# EAGLE design RtNixie (EAGLE 6.1)
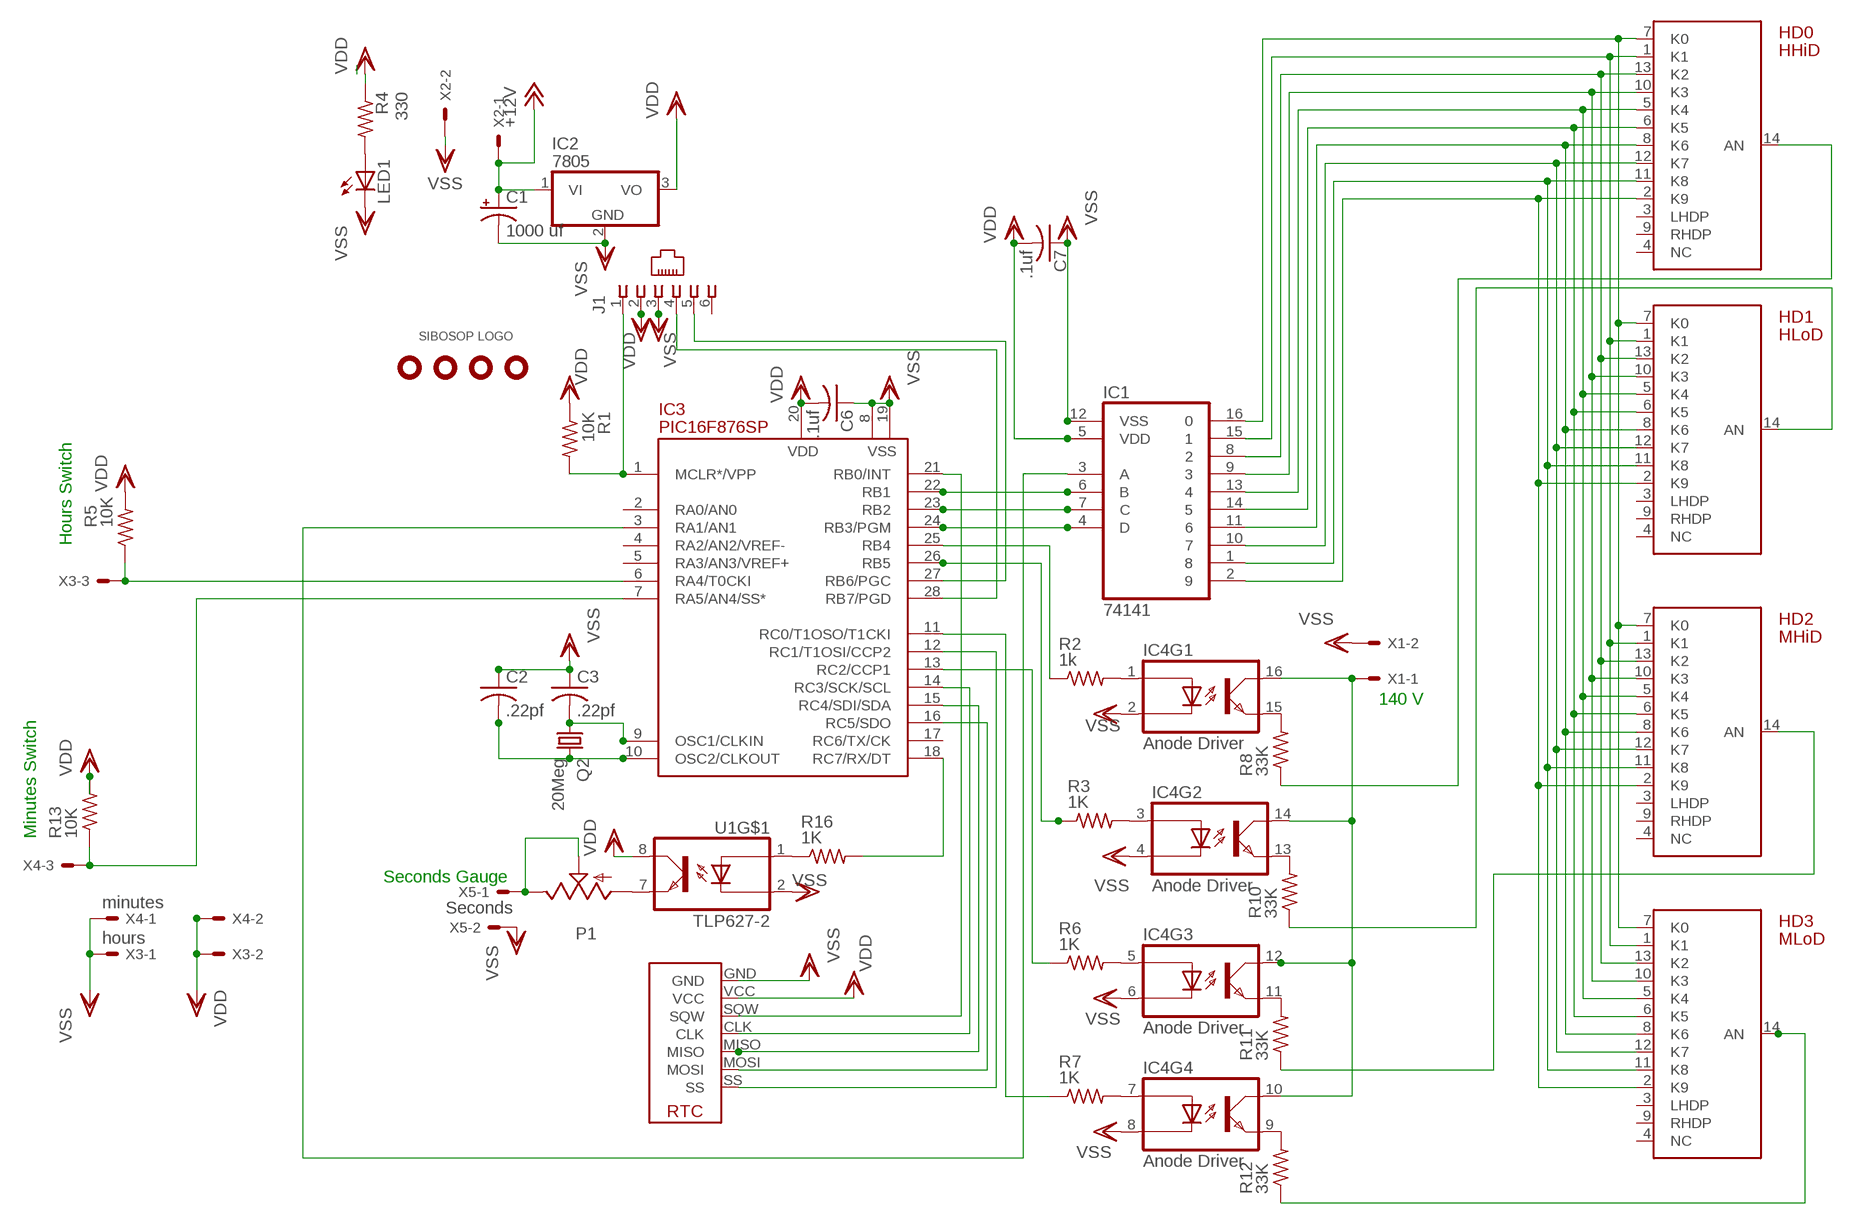
[diagram p0: schematic, sheet 1]

## Parts
C1  1000 uf  CPOL-USE3.5-10  [E3,5-10]
C2  .22pf  C-US025-024X044  [C025-024X044]
C3  .22pf  C-US025-024X044  [C025-024X044]
C6  .1uf  C-US025-024X044  [C025-024X044]
C7  .1uf  C-US025-024X044  [C025-024X044]
HD0  HHiD  NIXIE-5440-HEADER  [DIL14]
HD1  HLoD  NIXIE-5440-HEADER  [DIL14]
HD2  MHiD  NIXIE-5440-HEADER  [DIL14]
HD3  MLoD  NIXIE-5440-HEADER  [DIL14]
IC1  74141  [DIP16]
IC2  7805  [TO220V]
IC3  PIC16F876SP  [DIL28-3]
IC4  Anode Driver  TLP627  [DIP16]
IC5  SPARKRTC  [SPARKRTC]
J1  520250-3  [520250-3]
LED1  LEDSQR2X5  [LED2X5]
P1  TRIMPOT  [RJ6S]
Q2  20Meg  CRYSTALHC49S  [HC49/S]
R1  10K  R-US_0204/2V  [0204V]
R2  1k  R-US_0204/2V  [0204V]
R3  1K  R-US_0204/2V  [0204V]
R4  330  R-US_0204/2V  [0204V]
R5  10K  R-US_0204/2V  [0204V]
R6  1K  R-US_0204/2V  [0204V]
R7  1K  R-US_0204/2V  [0204V]
R8  33K  R-US_0204/2V  [0204V]
R10  33K  R-US_0204/2V  [0204V]
R11  33K  R-US_0204/2V  [0204V]
R12  33K  R-US_0204/2V  [0204V]
R13  10K  R-US_0204/2V  [0204V]
R16  1K  R-US_0204/2V  [0204V]
U1  TLP627-2  [DIL8]
U$1  HOLE-125  [HOLE-125]
U$2  HOLE-125  [HOLE-125]
U$3  LOGO  [LOGO]
U$5  HOLE-125  [HOLE-125]
U$7  HOLE-125  [HOLE-125]
X1  22-23-2021  [22-23-2021]
X2  22-23-2021  [22-23-2021]
X3  hours  22-23-2031  [22-23-2031]
X4  minutes  22-23-2031  [22-23-2031]
X5  Seconds  22-23-2021  [22-23-2021]

## Nets
+12V: C1.+ IC2.1(VI) X2.1
N$1: IC3.28(RB7/PGD) J1.4
N$2: IC3.7(RA5/AN4/SS*) R13.1 X4.3
N$3: C2.2 IC3.10(OSC2/CLKOUT) Q2.2
N$4: C3.2 IC3.9(OSC1/CLKIN) Q2.1
N$5: IC3.27(RB6/PGC) J1.5
N$6: IC3.1(MCLR*/VPP) J1.1 R1.2
N$7: HD0.7(K0) HD1.7(K0) HD2.7(K0) HD3.7(K0) IC1.16
N$8: HD0.1(K1) HD1.1(K1) HD2.1(K1) HD3.1(K1) IC1.15
N$9: HD0.13(K2) HD1.13(K2) HD2.13(K2) HD3.13(K2) IC1.8
N$10: HD0.10(K3) HD1.10(K3) HD2.10(K3) HD3.10(K3) IC1.9
N$11: HD0.5(K4) HD1.5(K4) HD2.5(K4) HD3.5(K4) IC1.13
N$12: P1.E P1.S X5.1
N$13: HD0.8(K6) HD1.8(K6) HD2.8(K6) HD3.8(K6) IC1.11
N$14: HD0.12(K7) HD1.12(K7) HD2.12(K7) HD3.12(K7) IC1.10
N$15: HD0.11(K8) HD1.11(K8) HD2.11(K8) HD3.11(K8) IC1.1
N$16: HD0.2(K9) HD1.2(K9) HD2.2(K9) HD3.2(K9) IC1.2
N$17: IC1.6(B) IC3.22(RB1)
N$18: IC1.7(C) IC3.23(RB2)
N$19: IC1.4(D) IC3.24(RB3/PGM)
N$20: IC3.21(RB0/INT) IC5.SQW
N$21: HD0.6(K5) HD1.6(K5) HD2.6(K5) HD3.6(K5) IC1.14
N$22: LED1.A R4.2
N$23: P1.A U1.7(EM)
N$24: IC4.1(AN) R2.2
N$25: IC4.5(AN) R6.2
N$26: IC4.7(AN) R7.2
N$27: IC3.25(RB4) R2.1
N$28: IC3.26(RB5) R3.1
N$29: IC3.13(RC2/CCP1) R6.1
N$30: R16.1 U1.1(AN)
N$31: IC3.14(RC3/SCK/SCL) IC5.CLK
N$32: IC3.6(RA4/T0CKI) R5.1 X3.3
N$33: IC4.3(AN) R3.2
N$34: IC3.15(RC4/SDI/SDA) IC5.MISO
N$35: IC4.15(EM) R8.2
N$36: IC4.13(EM) R10.2
N$37: IC4.11(EM) R11.2
N$38: IC4.9(EM) R12.2
N$39: HD0.14(AN) R8.1
N$40: HD1.14(AN) R10.1
N$41: HD2.14(AN) R11.1
N$42: HD3.14(AN) R12.1
N$43: IC3.16(RC5/SDO) IC5.MOSI
N$44: IC1.3(A) IC3.3(RA1/AN1)
N$45: IC3.11(RC0/T1OSO/T1CKI) R7.1
N$46: IC3.12(RC1/T1OSI/CCP2) IC5.SS
N$57: IC3.18(RC7/RX/DT) R16.2
N$61: IC4.10(CO) IC4.12(CO) IC4.14(CO) IC4.16(CO) X1.1
VDD: C6.2 C7.2 IC1.5(VDD) IC2.3(VO) IC3.20(VDD) IC5.VCC J1.2 R1.1 R4.1 R5.2 R13.2 U1.8(CO) X3.2 X4.2
VSS: C1.- C2.1 C3.1 C6.1 C7.1 IC1.12(VSS) IC2.2(GND) IC3.8(VSS) IC3.19(VSS) IC4.2(CA) IC4.4(CA) IC4.6(CA) IC4.8(CA) IC5.GND J1.3 LED1.K(C) U1.2(CA) X1.2 X2.2 X3.1 X4.1 X5.2
Unconnected: HD0.3(LHDP) HD0.4(NC) HD0.9(RHDP) HD1.3(LHDP) HD1.4(NC) HD1.9(RHDP) HD2.3(LHDP) HD2.4(NC) HD2.9(RHDP) HD3.3(LHDP) HD3.4(NC) HD3.9(RHDP) IC3.2(RA0/AN0) IC3.4(RA2/AN2/VREF-) IC3.5(RA3/AN3/VREF+) IC3.17(RC6/TX/CK) J1.6 U1.3(AN) U1.4(CA) U1.5(EM) U1.6(CO)

## Notes on the sheet
- Hours Switch
- 140 V
- Minutes Switch
- Seconds Gauge

## Library data of the parts
C1 = rcl:CPOL-US: POLARIZED CAPACITOR, American symbol
C2 C3 C6 C7 = rcl:C-US: CAPACITOR, American symbol
HD0 HD1-HD3 = sibosop:NIXIE-5440-HEADER: 14 pin dip header used to interface with a Nixie 5440 type tube
IC1 = sibosop:74141: Nixie BCD Decoder
IC2 = kmarx1:78*: 78xx Family - Positive voltage regulator
IC3 = pic16f87x:PIC16F876: FLASH MICROCONTROLLER
IC4 = sibosop:TLP627: Toshiba 4 unit photocoupler
IC5 = sibosop:SPARKRTC: spark fun deadon rtc breakout board
J1 = con-amp:520250-3: AMP connector
LED1 = led:LED: LED OSRAM: - CHIPLED LG R971, LG N971, LY N971, LG Q971, LY Q971, LO R971, LY R971 LH N974, LH R974 LS Q976, LO Q976, LY Q976 LO Q996 - Hyper CHIPLED LW Q18S LB Q993, LB Q99A, LB R99A - SideLED LS A670, LO A670, LY A670, LG A670, LP A670 LB A673, LV A673, LT A673, LW A673 LH A674 LY A675 LS A676, LA A676, LO A676, LY A676, LW A676 LS A679, LY A679, LG A679 - Hyper Micro SIDELED® LS Y876, LA Y876, LO Y876, LY Y876 LT Y87S - SmartLED LW L88C, LW L88S LB L89C, LB L89S, LG L890 LS L89K, LO L89K, LY L89K LS L896, LA L896, LO L896, LY L896 - TOPLED LS T670, LO T670, LY T670, LG T670, LP T670 LSG T670, LSP T670, LSY T670, LOP T670, LYG T670 LG T671, LOG T671, LSG T671 LB T673, LV T673, LT T673, LW T673 LH T674 LS T676, LA T676, LO T676, LY T676, LB T676, LH T676, LSB T676, LW T676 LB T67C, LV T67C, LT T67C, LS T67K, LO T67K, LY T67K, LW E67C LS E67B, LA E67B, LO E67B, LY E67B, LB E67C, LV E67C, LT E67C LW T67C LS T679, LY T679, LG T679 LS T770, LO T770, LY T770, LG T770, LP T770 LB T773, LV T773, LT T773, LW T773 LH T774 LS E675, LA E675, LY E675, LS T675 LS T776, LA T776, LO T776, LY T776, LB T776 LHGB T686 LT T68C, LB T68C - Hyper Mini TOPLED® LB M676 - Mini TOPLED Santana® LG M470 LS M47K, LO M47K, LY M47K Source: http://www.osram.convergy.de LUXEON: - LUMILED® LXK2-PW12-R00, LXK2-PW12-S00, LXK2-PW14-U00, LXK2-PW14-V00 LXK2-PM12-R00, LXK2-PM12-S00, LXK2-PM14-U00 LXK2-PE12-Q00, LXK2-PE12-R00, LXK2-PE12-S00, LXK2-PE14-T00, LXK2-PE14-U00 LXK2-PB12-K00, LXK2-PB12-L00, LXK2-PB12-M00, LXK2-PB14-N00, LXK2-PB14-P00, LXK2-PB14-Q00 LXK2-PR12-L00, LXK2-PR12-M00, LXK2-PR14-Q00, LXK2-PR14-R00 LXK2-PD12-Q00, LXK2-PD12-R00, LXK2-PD12-S00 LXK2-PH12-R00, LXK2-PH12-S00 LXK2-PL12-P00, LXK2-PL12-Q00, LXK2-PL12-R00 Source: www.luxeon.com KINGBRIGHT: KA-3528ASYC Source: www.kingbright.com
P1 = sibosop:TRIMPOT
Q2 = crystal:CRYSTAL: CRYSTAL; OC_FARNELL: 1667008; OC_NEWARK: unknown
R1-R8 R10-R13 R16 = rcl:R-US_: RESISTOR, American symbol
U1 = sibosop:TLP627-2: 2 unit Hi voltage opto-isolator
U$1 U$2 U$5 U$7 = sibosop:HOLE-125
U$3 = sibosop:LOGO
X1 X2 X5 = sibosop-con-molex:22-23-2021: .100" (2.54mm) Center Header - 2 Pin
X3 X4 = sibosop-con-molex:22-23-2031: .100" (2.54mm) Center Header - 3 Pin

## Board
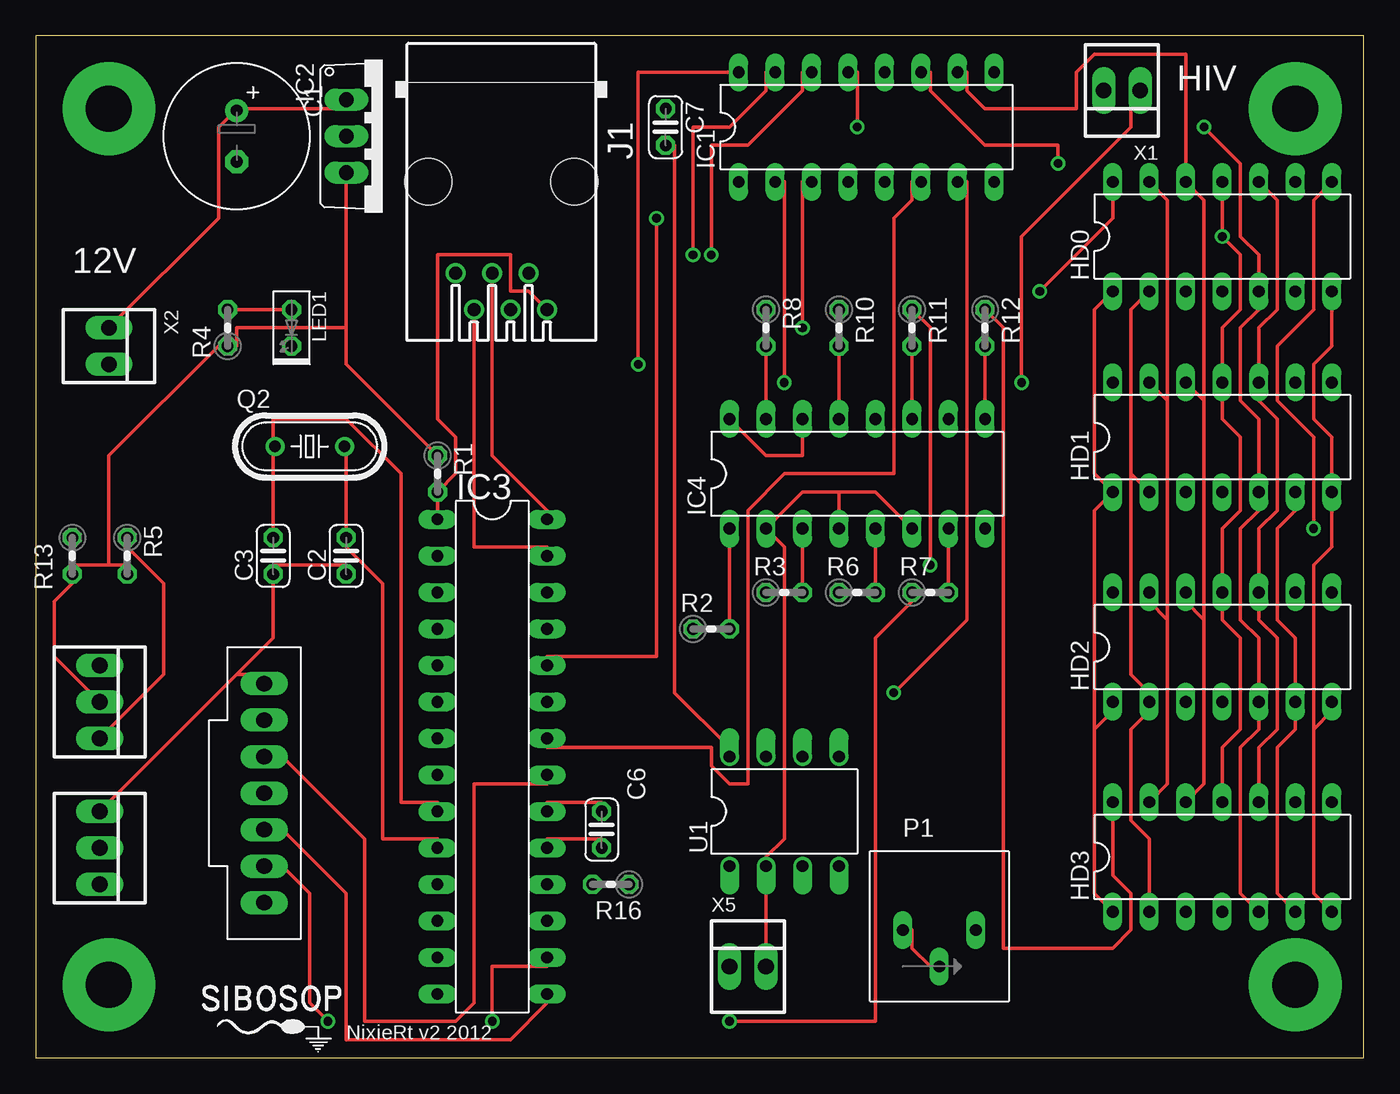
[diagram p1: board, top side]
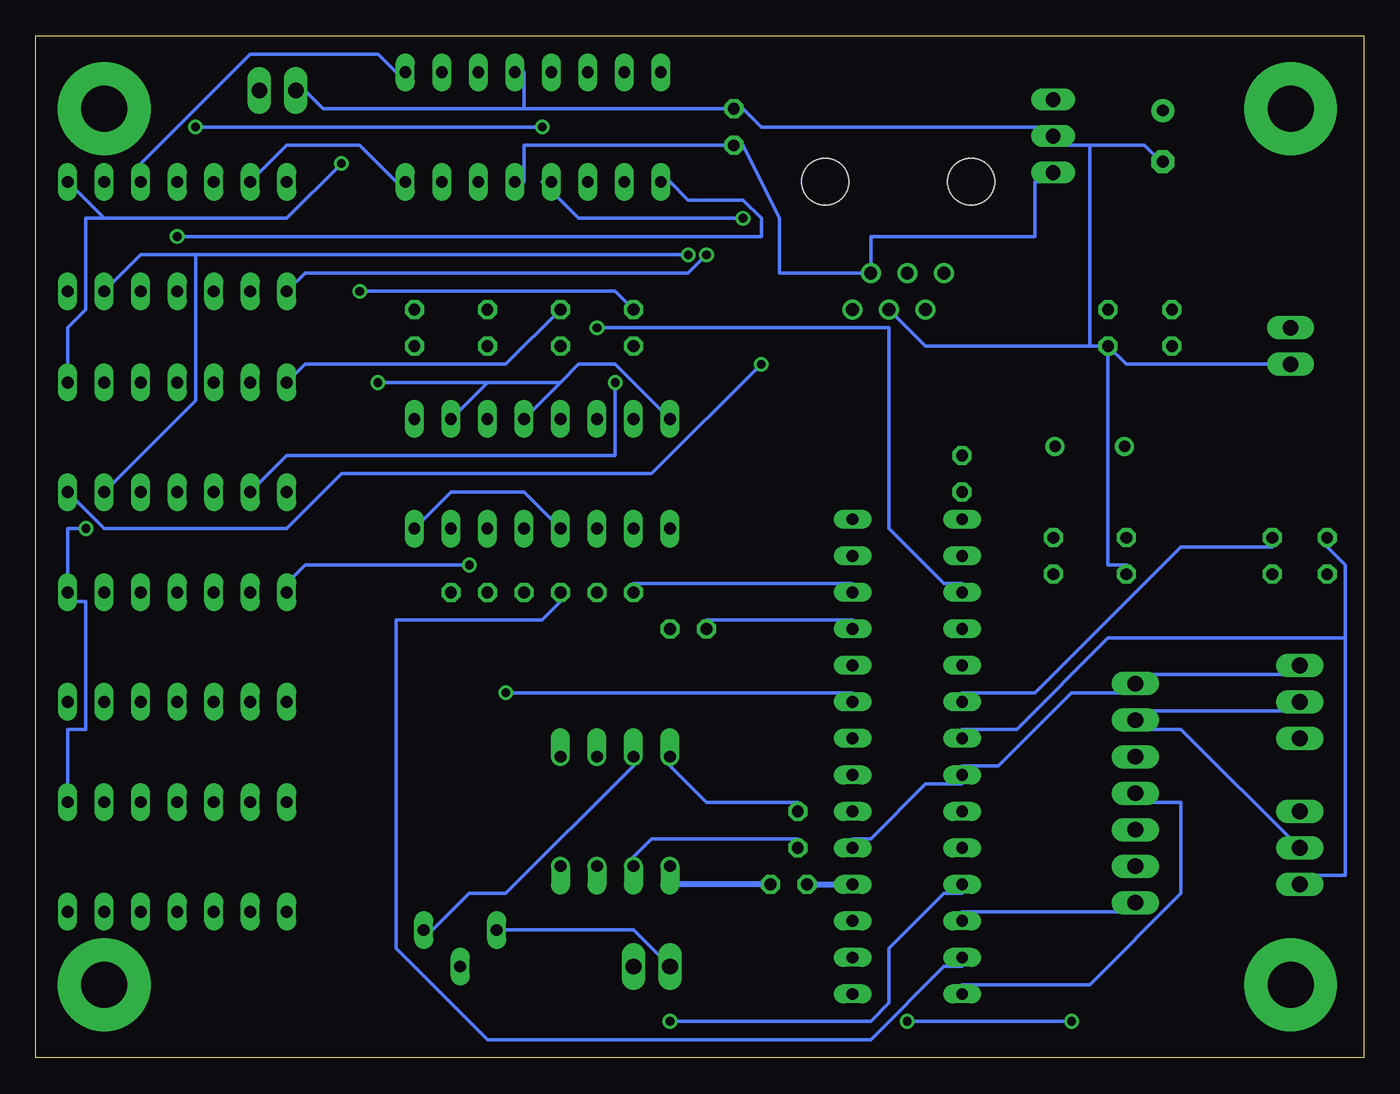
[diagram p2: board, bottom side, seen from below]

Size 92.38 x 71.11 mm. Coordinates in mm from the lower left corner, seen from the top.
Outline: 0,0 92.38,0 92.38,71.11 0,71.11 0,0
Copper layers (1*16): Top 0.035mm / dielectric 1.5mm / Bottom 0.035mm
Design rules: minimum track width 10mil, minimum drill 24mil, track to track 8mil, track to pad 8mil, pad to pad 8mil, via to via 8mil, smd to smd 8mil, copper to edge 40mil, drill to drill 8mil, minimum pad ring 10mil, minimum via ring 8mil, stop-mask expansion 4mil, vias tented up to drill 0mil, thermal gap 10mil

### Footprints (pad centres in the part's own frame; a part is rotated, then mirrored left to right if it is on the bottom)
E3,5-10 = drill 0.813 pad 1.6: + -1.778,0 | drill 0.813 pad 1.6 octagon: - 1.778,0
C025-024X044 = drill 0.813 octagon: 1 -1.27,0; 2 1.27,0
DIL14 = drill 0.813 long: 1 -7.62,-3.81; 2 -5.08,-3.81; 3 -2.54,-3.81; 4 0,-3.81; 5 2.54,-3.81; 6 5.08,-3.81; 7 7.62,-3.81; 8 7.62,3.81; 9 5.08,3.81; 10 2.54,3.81; 11 0,3.81; 12 -2.54,3.81; 13 -5.08,3.81; 14 -7.62,3.81
DIP16 = drill 0.813 long: 1 -8.89,-3.81; 2 -6.35,-3.81; 3 -3.81,-3.81; 4 -1.27,-3.81; 5 1.27,-3.81; 6 3.81,-3.81; 7 6.35,-3.81; 8 8.89,-3.81; 9 8.89,3.81; 10 6.35,3.81; 11 3.81,3.81; 12 1.27,3.81; 13 -1.27,3.81; 14 -3.81,3.81; 15 -6.35,3.81; 16 -8.89,3.81
TO220V = drill 1.016 long: 1 -2.54,0; 2 0,0; 3 2.54,0
DIL28-3 = drill 0.813 long: 1 -16.51,-3.81; 2 -13.97,-3.81; 3 -11.43,-3.81; 4 -8.89,-3.81; 5 -6.35,-3.81; 6 -3.81,-3.81; 7 -1.27,-3.81; 8 1.27,-3.81; 9 3.81,-3.81; 10 6.35,-3.81; 11 8.89,-3.81; 12 11.43,-3.81; 13 13.97,-3.81; 14 16.51,-3.81; 15 16.51,3.81; 16 13.97,3.81; 17 11.43,3.81; 18 8.89,3.81; 19 6.35,3.81; 20 3.81,3.81; 21 1.27,3.81; 22 -1.27,3.81; 23 -3.81,3.81; 24 -6.35,3.81; 25 -8.89,3.81; 26 -11.43,3.81; 27 -13.97,3.81; 28 -16.51,3.81
SPARKRTC = drill 1.1 long: CLK 0,0; GND 0,-7.62; MISO 0,2.54; MOSI 0,5.08; SQW 0,-2.54; SS 0,7.62; VCC 0,-5.08
520250-3 = drill 0.889: 1 -3.175,8.89; 2 -1.905,6.35; 3 -0.635,8.89; 4 0.635,6.35; 5 1.905,8.89; 6 3.175,6.35 | hole 3.251: -5.08,0; 5.08,0
LED2X5 = drill 0.813 octagon: A -1.27,0; K 1.27,0
RJ6S = drill 0.813 long: A 2.54,0; E -2.54,0; S 0,-2.54
HC49/S = drill 0.813: 1 -2.413,0; 2 2.413,0
0204V = drill 0.813 octagon: 1 -1.27,0; 2 1.27,0
DIL8 = drill 0.813 offset: 1 -3.81,-3.81; 2 -1.27,-3.81; 3 1.27,-3.81; 4 3.81,-3.81; 5 3.81,3.81; 6 1.27,3.81; 7 -1.27,3.81; 8 -3.81,3.81
HOLE-125 = drill 3.2 pad 6.452: P$1 0,0
22-23-2021 = drill 1.1 long: 1 -1.27,0; 2 1.27,0
22-23-2031 = drill 1.1 long: 1 -2.54,0; 2 0,0; 3 2.54,0

### Placement (x,y rotation side)
C1  13.97,64.14 270 top
C2  21.59,34.92 90 top
C3  16.51,34.92 90 top
C6  39.37,15.88 90 top
C7  43.81,64.77 270 top
HD0  82.55,57.15 0 top
HD1  82.55,43.18 0 top
HD2  82.55,28.57 0 top
HD3  82.55,13.97 0 top
IC1  57.78,64.77 0 top
IC2  21.59,64.14 270 top
IC3  31.75,20.95 270 top
IC4  57.15,40.64 0 top
IC5  15.88,18.41 180 top
J1  32.38,60.96 180 top
LED1  17.78,50.8 270 top
P1  62.87,8.89 0 top
Q2  19.05,42.55 0 top
R1  27.94,40.64 270 top
R2  46.99,29.84 0 top
R3  52.07,32.38 0 top
R4  13.34,50.8 90 top
R5  6.35,34.92 270 top
R6  57.15,32.38 0 top
R7  62.23,32.38 0 top
R8  50.8,50.8 270 top
R10  55.88,50.8 270 top
R11  60.96,50.8 270 top
R12  66.04,50.8 270 top
R13  2.54,34.92 270 top
R16  40.01,12.06 180 top
U1  52.07,17.14 0 top
U$1  5.08,66.04 0 top
U$2  5.08,5.08 0 top
U$3  15.88,3.81 0 top
U$5  87.63,5.08 0 top
U$7  87.63,66.04 0 top
X1  75.56,67.31 180 top
X2  5.08,49.53 270 top
X3  4.45,24.77 270 top
X4  4.45,14.61 270 top
X5  49.53,6.35 0 top

### Tracks (layer width: path | path; a pad name or v marks a point on that pad's centre or on a via)
+12V
  Top 0.254: 13.97,66.04 21.59,66.04 IC2.1 | X2.1 12.7,58.42 12.7,64.77 13.97,66.04 | 13.97,66.04 C1.+
N$1
  Top 0.254: J1.4 31.75,41.91 35.56,38.1 IC3.28
N$2
  Bottom 0.254: 1.27,29.21 1.27,12.7 3.81,12.7 X4.3 | 1.27,29.21 1.27,34.29 2.54,35.56 R13.1 | 1.27,29.21 17.78,29.21 24.13,22.86 27.94,22.86 IC3.7
N$3
  Top 0.254: Q2.2 21.59,41.91 C2.2 21.59,35.56 24.13,33.02 24.13,15.24 27.94,15.24 IC3.10
N$4
  Top 0.254: C3.2 16.51,41.91 Q2.1 16.51,43.18 16.51,44.45 21.59,44.45 25.4,40.64 25.4,17.78 27.94,17.78 IC3.9
N$5
  Top 0.254: J1.5 30.48,35.56 35.56,35.56 IC3.27
N$6
  Top 0.254: IC3.1 R1.2 29.21,40.64 29.21,43.18 27.94,44.45 27.94,55.88 33.02,55.88 33.02,53.34 34.29,53.34 J1.1
N$7  (via drill 0.61)
  Top 0.254: HD3.7 88.9,11.43 88.9,22.86 | 88.9,22.86 90.17,24.13 HD2.7 | 88.9,22.86 88.9,34.29 90.17,35.56 HD1.7 90.17,43.18 88.9,44.45 88.9,48.26 90.17,49.53 HD0.7 | IC1.16 41.91,68.58 v41.91,48.26
  Bottom 0.254: v41.91,48.26 49.53,40.64 71.12,40.64 74.93,36.83 87.63,36.83 HD1.7
N$8  (via drill 0.61)
  Top 0.254: HD3.1 73.66,11.43 73.66,22.86 | 73.66,22.86 74.93,24.13 HD2.1 | 73.66,22.86 73.66,38.1 HD1.1 73.66,40.64 73.66,52.07 HD0.1 | v45.72,55.88 45.72,64.77 48.26,64.77 50.8,67.31 50.8,68.58 IC1.15
  Bottom 0.254: v45.72,55.88 46.99,54.61 73.66,54.61 HD0.1
N$9
  Top 0.254: HD3.13 78.74,19.05 78.74,30.48 | 78.74,30.48 77.47,31.75 HD2.13 | 78.74,45.72 HD1.13 | 78.74,30.48 78.74,45.72 | HD0.13 78.74,59.69 78.74,45.72
  Bottom 0.254: HD0.13 74.93,63.5 69.85,63.5 67.31,60.96 IC1.8
N$10
  Top 0.254: HD3.10 85.09,21.59 86.36,22.86 86.36,29.21 85.09,30.48 HD2.10 85.09,36.83 86.36,38.1 86.36,44.45 85.09,45.72 HD1.10 85.09,50.8 86.36,52.07 86.36,59.69 HD0.10
  Bottom 0.254: HD0.10 85.09,62.23 77.47,69.85 68.58,69.85 67.31,68.58 IC1.9
N$11  (via drill 0.61)
  Top 0.254: HD3.5 83.82,11.43 83.82,21.59 85.09,22.86 HD2.5 85.09,29.21 83.82,30.48 83.82,36.83 85.09,38.1 HD1.5 85.09,44.45 83.82,45.72 83.82,50.8 85.09,52.07 HD0.5 85.09,55.88 83.82,57.15 83.82,62.23 v81.28,64.77 | v57.15,64.77 57.15,68.58 IC1.13
  Bottom 0.254: v81.28,64.77 v57.15,64.77
N$12
  Top 0.254: P1.S 62.23,6.35 60.96,7.62 60.96,8.89 P1.E
  Bottom 0.254: X5.1 50.8,8.89 P1.E
N$13  (via drill 0.61)
  Top 0.254: v71.12,62.23 71.12,63.5 66.04,63.5 62.23,67.31 62.23,68.58 IC1.11 | v88.9,36.83 88.9,43.18 86.36,45.72 86.36,49.53 88.9,52.07 88.9,59.69 HD0.8
  Bottom 0.254: HD3.8 90.17,22.86 88.9,22.86 88.9,31.75 90.17,31.75 HD2.8 90.17,36.83 v88.9,36.83 | v71.12,62.23 74.93,58.42 87.63,58.42 | HD0.8 87.63,58.42 | HD1.8 90.17,50.8 88.9,52.07 88.9,58.42 87.63,58.42
N$14
  Top 0.254: HD3.12 81.28,19.05 81.28,30.48 | 81.28,30.48 80.01,31.75 HD2.12 | 81.28,45.72 HD1.12 | 81.28,30.48 81.28,45.72 | 81.28,45.72 81.28,59.69 HD0.12 80.01,69.85 73.66,69.85 72.39,68.58 72.39,66.04 66.04,66.04 64.77,67.31 64.77,68.58 IC1.10
N$15  (via drill 0.61)
  Top 0.254: HD3.11 82.55,21.59 83.82,22.86 83.82,29.21 82.55,30.48 HD2.11 82.55,36.83 83.82,38.1 83.82,43.18 82.55,44.45 HD1.11 82.55,50.8 83.82,52.07 83.82,55.88 v82.55,57.15 HD0.11
  Bottom 0.254: v82.55,57.15 41.91,57.15 41.91,58.42 43.18,59.69 46.99,59.69 48.26,60.96 IC1.1
N$16  (via drill 0.61)
  Top 0.254: HD3.2 77.47,15.24 76.2,16.51 76.2,22.86 77.47,24.13 HD2.2 77.47,25.4 76.2,26.67 76.2,40.64 | v52.07,46.99 52.07,60.96 IC1.2 | HD0.2 76.2,52.07 76.2,40.64 | HD1.2 76.2,40.64
  Bottom 0.254: v52.07,46.99 52.07,41.91 74.93,41.91 HD1.2
N$17
  Top 0.254: IC3.22 35.56,21.59 46.99,21.59 46.99,20.32 48.26,19.05 49.53,19.05 49.53,38.1 52.07,40.64 59.69,40.64 59.69,58.42 60.96,59.69 60.96,60.96 IC1.6
N$18  (via drill 0.61)
  Top 0.254: v59.69,25.4 64.77,30.48 64.77,60.96 IC1.7
  Bottom 0.254: v59.69,25.4 35.56,25.4 IC3.23
N$19  (via drill 0.61)
  Top 0.254: v43.18,58.42 43.18,27.94 35.56,27.94 IC3.24
  Bottom 0.254: v43.18,58.42 54.61,58.42 57.15,60.96 IC1.4
N$20
  Top 0.254: IC3.21 35.56,19.05 30.48,19.05 30.48,3.81 29.21,2.54 22.86,2.54 22.86,15.24 16.51,21.59 IC5.SQW
N$21  (via drill 0.61)
  Top 0.254: HD3.6 86.36,11.43 86.36,21.59 87.63,22.86 HD2.6 87.63,29.21 86.36,30.48 86.36,36.83 87.63,38.1 HD1.6 | v46.99,55.88 46.99,63.5 49.53,63.5 53.34,67.31 53.34,68.58 IC1.14
  Bottom 0.254: 81.28,55.88 85.09,55.88 HD0.6 | 81.28,55.88 v46.99,55.88 | HD1.6 81.28,45.72 81.28,55.88
N$22
  Top 0.254: LED1.A R4.2
N$23
  Bottom 0.254: U1.7 50.8,20.32 59.69,11.43 62.23,11.43 64.77,8.89 P1.A
N$24
  Top 0.254: IC4.1 R2.2
N$25
  Top 0.254: IC4.5 R6.2
N$26
  Top 0.254: IC4.7 R7.2
N$27
  Bottom 0.254: IC3.25 35.56,30.48 45.72,30.48 R2.1
N$28
  Bottom 0.254: IC3.26 35.56,33.02 50.8,33.02 R3.1
N$29
  Bottom 0.254: IC3.13 27.94,6.35 29.21,6.35 34.29,1.27 60.96,1.27 67.31,7.62 67.31,30.48 57.15,30.48 55.88,31.75 R6.1
N$30
  Bottom 0.406: R16.1 48.26,12.06 U1.1
N$31
  Bottom 0.254: IC3.14 27.94,5.08 19.05,5.08 12.7,11.43 12.7,17.78 15.24,17.78 IC5.CLK
N$32
  Top 0.254: X3.3 8.89,26.67 8.89,33.02 6.35,35.56 R5.1
  Bottom 0.254: IC3.6 27.94,25.4 22.86,25.4 12.7,35.56 6.35,35.56 R5.1
N$33
  Top 0.254: IC4.3 R3.2
N$34
  Top 0.254: IC3.15 35.56,3.81 33.02,1.27 21.59,1.27 21.59,11.43 16.51,16.51 IC5.MISO
N$35
  Top 0.254: R8.2 IC4.15
N$36
  Top 0.254: R10.2 IC4.13
N$37
  Top 0.254: R11.2 IC4.11
N$38
  Top 0.254: R12.2 IC4.9
N$39  (via drill 0.61)
  Top 0.254: v69.85,53.34 74.93,58.42 HD0.14
  Bottom 0.254: R8.1 52.07,53.34 v69.85,53.34
N$40
  Bottom 0.254: R10.1 59.69,48.26 73.66,48.26 HD1.14
N$41  (via drill 0.61)
  Top 0.254: v62.23,34.29 62.23,50.8 R11.1
  Bottom 0.254: v62.23,34.29 73.66,34.29 74.93,33.02 HD2.14
N$42
  Top 0.254: HD3.14 74.93,12.7 76.2,11.43 76.2,8.89 74.93,7.62 67.31,7.62 67.31,50.8 R12.1
N$43  (via drill 0.61)
  Top 0.254: v31.75,2.54 31.75,6.35 35.56,6.35 IC3.16 | v20.32,2.54 19.05,3.81 19.05,11.43 16.51,13.97 IC5.MOSI
  Bottom 0.254: v20.32,2.54 v31.75,2.54
N$44  (via drill 0.61)
  Top 0.254: v53.34,50.8 53.34,60.96 IC1.3
  Bottom 0.254: v53.34,50.8 33.02,50.8 33.02,36.83 29.21,33.02 27.94,33.02 IC3.3
N$45  (via drill 0.61)
  Top 0.254: v48.26,2.54 58.42,2.54 58.42,29.21 60.96,31.75 R7.1
  Bottom 0.254: v48.26,2.54 34.29,2.54 33.02,3.81 33.02,7.62 29.21,11.43 27.94,11.43 IC3.11
N$46
  Bottom 0.254: IC3.12 27.94,10.16 16.51,10.16 IC5.SS
N$57
  Bottom 0.406: R16.2 IC3.18
N$61  (via drill 0.61)
  Top 0.254: IC4.16 50.8,41.91 53.34,41.91 IC4.14 | v68.58,46.99 68.58,57.15 76.2,64.77 76.2,67.31 X1.1
  Bottom 0.254: 55.88,46.99 54.61,48.26 52.07,48.26 IC4.16 | 55.88,46.99 IC4.12 | 60.96,46.99 IC4.10 | 55.88,46.99 60.96,46.99 | 60.96,46.99 v68.58,46.99
VDD
  Top 0.254: IC3.20 35.56,17.78 39.37,17.78 C6.2 | U1.8 48.26,21.59 44.45,25.4 44.45,63.5 C7.2 | R1.1 21.59,48.26 21.59,50.8 | IC2.3 21.59,50.8 | 5.08,34.29 6.35,34.29 R5.2 | 5.08,34.29 2.54,34.29 R13.2 2.54,33.02 1.27,31.75 1.27,27.94 X3.2 | 5.08,34.29 5.08,41.91 12.7,49.53 R4.1 13.97,49.53 13.97,50.8 21.59,50.8
  Bottom 0.254: U1.8 48.26,20.32 45.72,17.78 39.37,17.78 C6.2 | IC1.5 58.42,60.96 58.42,63.5 C7.2 43.18,63.5 40.64,58.42 40.64,54.61 J1.2 34.29,57.15 22.86,57.15 22.86,60.96 21.59,60.96 IC2.3 | X4.2 12.7,22.86 15.24,22.86 IC5.VCC 15.24,24.13 5.08,24.13 X3.2
VSS
  Top 0.254: C2.1 21.59,34.29 16.51,34.29 C3.1 16.51,29.21 13.97,26.67 | 13.97,26.67 X4.1 | 13.97,26.67 15.24,26.67 IC5.GND | 55.88,39.37 53.34,39.37 IC4.2 52.07,35.56 52.07,15.24 50.8,13.97 U1.2 X5.2 | IC4.4 55.88,39.37 | IC4.6 58.42,39.37 55.88,39.37 | IC3.19 35.56,15.24 39.37,15.24 C6.1
  Bottom 0.254: LED1.K 16.51,48.26 X2.2 | J1.3 30.48,49.53 19.05,49.53 | LED1.K 19.05,49.53 | 58.42,66.04 58.42,68.58 IC1.12 | 58.42,66.04 C7.1 43.18,66.04 41.91,64.77 21.59,64.77 IC2.2 21.59,63.5 19.05,63.5 | 19.05,63.5 15.24,63.5 13.97,62.23 C1.- | 58.42,66.04 72.39,66.04 73.66,67.31 X1.2 | 19.05,63.5 19.05,49.53 | X3.1 5.08,26.67 15.24,26.67 IC5.GND 16.51,25.4 20.32,25.4 25.4,20.32 27.94,20.32 IC3.8 27.94,19.05 30.48,19.05 34.29,15.24 35.56,15.24 IC3.19 | IC4.8 63.5,39.37 58.42,39.37 IC4.4 | U1.2 50.8,13.97 49.53,15.24 39.37,15.24 C6.1 | LED1.K 17.78,34.29 16.51,34.29 C3.1

### Text on the board
tNames: HIV | 12V | NixieRt v2 2012